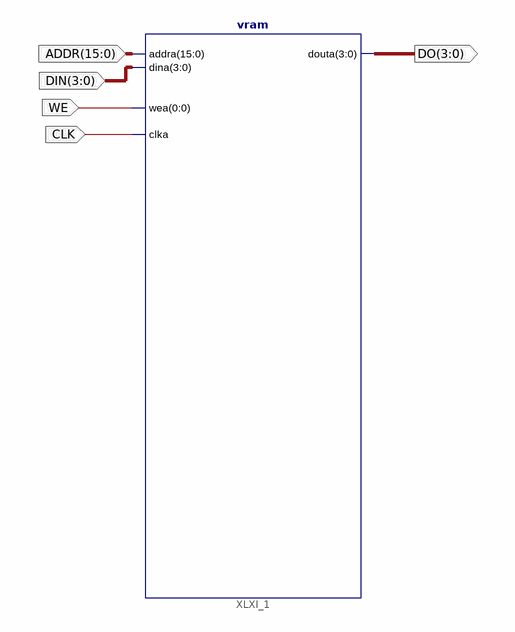
[diagram p0: schematic sheet 1]
// Xilinx ISE schematic vram_wrapper.sch (spartan6) as structural Verilog: 1 symbols, 5 ports
module vram_wrapper (
  input  [15:0] ADDR,
  input  [3:0] DIN,
  input  WE,
  input  CLK,
  output [3:0] DO
);

  vram XLXI_1 (.addra(ADDR), .dina(DIN), .wea(WE), .clka(CLK), .douta(DO));
endmodule
